# Altium schematic sheet main.SchDoc
size A4; SheetNumber: 1; SheetTotal: 4
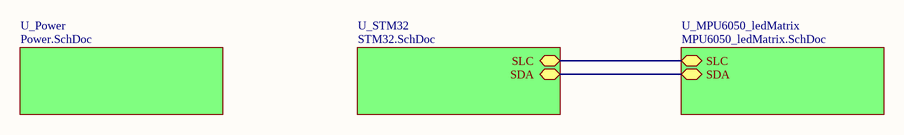
[diagram p0: main.SchDoc]

## Sub-sheets
U_MPU6050_ledMatrix = MPU6050_ledMatrix.SchDoc: SDA (bidir), SLC (bidir)
U_Power = Power.SchDoc: no entries
U_STM32 = STM32.SchDoc: SLC (bidir), SDA (bidir)

## Nets
(unnamed): sheet U_MPU6050_ledMatrix/SDA, sheet U_STM32/SDA
(unnamed): sheet U_MPU6050_ledMatrix/SLC, sheet U_STM32/SLC